# EAGLE design voltage_monitor (EAGLE 6.6.0)
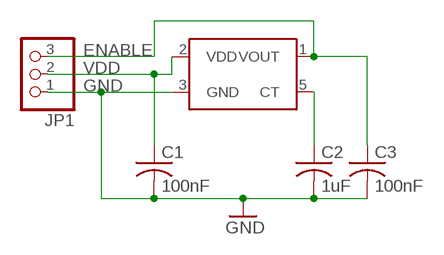
[diagram p0: schematic, sheet 1]

## Parts
C1  100nF  C-USC1206  [C1206]
C2  1uF  C-USC1206  [C1206]
C3  100nF  C-USC1206  [C1206]
JP1  PINHD-1X3  [1X03]
U$1  BD5260G  [SOT23-5]

## Nets
ENABLE: C3.1 JP1.3 U$1.1(VOUT)
GND: C1.2 C2.2 C3.2 JP1.1 U$1.3(GND)
N$4: C2.1 U$1.5(CT)
VDD: C1.1 JP1.2 U$1.2(VDD)

## Library data of the parts
C1-C3 = rcl:C-US: CAPACITOR, American symbol
JP1 = pinhead:PINHD-1X3: PIN HEADER
U$1 = zumy:BD5260G

## Board
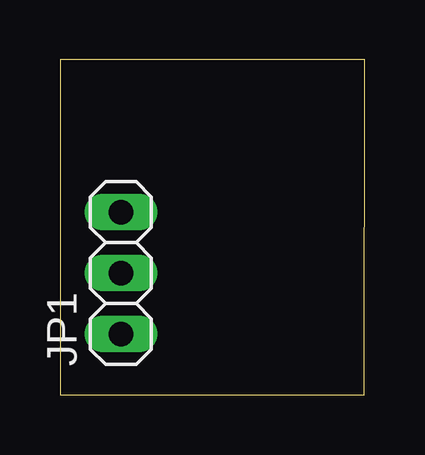
[diagram p1: board, top side]
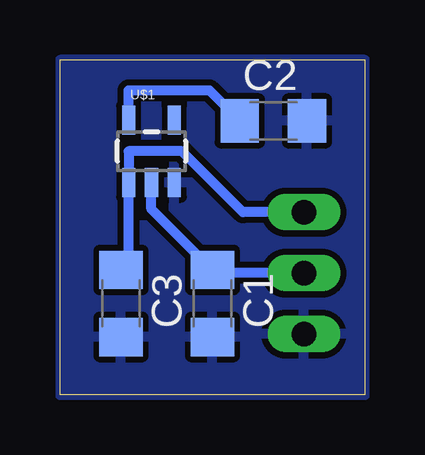
[diagram p2: board, bottom side, seen from below]

Size 12.7 x 13.97 mm. Coordinates in mm from the lower left corner, seen from the top.
Outline: 0,0 12.68,0 12.7,13.97 0,13.97 0,0
Copper layers (1*16): Top 0.035mm / dielectric 1.5mm / Bottom 0.035mm
Design rules "default *": minimum track width 10mil, minimum drill 24mil, track to track 8mil, track to pad 8mil, pad to pad 8mil, via to via 8mil, smd to smd 8mil, copper to edge 0mil, drill to drill 8mil, minimum pad ring 10mil, minimum via ring 8mil, stop-mask expansion 4mil, vias tented up to drill 0mil, thermal gap 10mil

### Footprints (pad centres in the part's own frame; a part is rotated, then mirrored left to right if it is on the bottom)
C1206 = smd 1.6 x 1.8: 1 -1.4,0; 2 1.4,0
1X03 = drill 1.016 long: 1 -2.54,0; 2 0,0; 3 2.54,0
SOT23-5 = smd 0.55 x 1.2: 1 -0.95,-1.3; 2 0,-1.3; 3 0.95,-1.3; 4 0.95,1.3; 5 -0.95,1.3

### Placement (x,y rotation side)
C1  6.35,3.81 270 bottom
C2  3.81,11.43 0 bottom
C3  10.16,3.81 270 bottom
JP1  2.54,5.08 90 top
U$1  8.89,10.16 0 bottom

### Tracks (layer width: path | path; a pad name or v marks a point on that pad's centre or on a via)
ENABLE
  Bottom 0.406: JP1.3 5.08,7.62 7.62,10.16 9.84,10.16 U$1.1 9.84,5.21 C3.1
GND
  pour Bottom (isolate 0.254): 0,0 0,13.97 12.7,13.97 12.7,0
N$4
  Bottom 0.406: U$1.5 9.84,12.7 6.48,12.7 C2.1
VDD
  Bottom 0.406: JP1.2 6.35,5.08 C1.1 8.89,7.75 U$1.2